# Altium schematic sheet GUAGE.SchDoc
size 420 x 297 mm; Date: 28.05.2024; ApprovedBy: Arda B.; CheckedBy: Arda B.; DrawnBy: Arda Bozkurt; Revision: 001; SheetNumber: 4; SheetTotal: 5; Department: HDD; Size: A3; Time: 28.05.2024
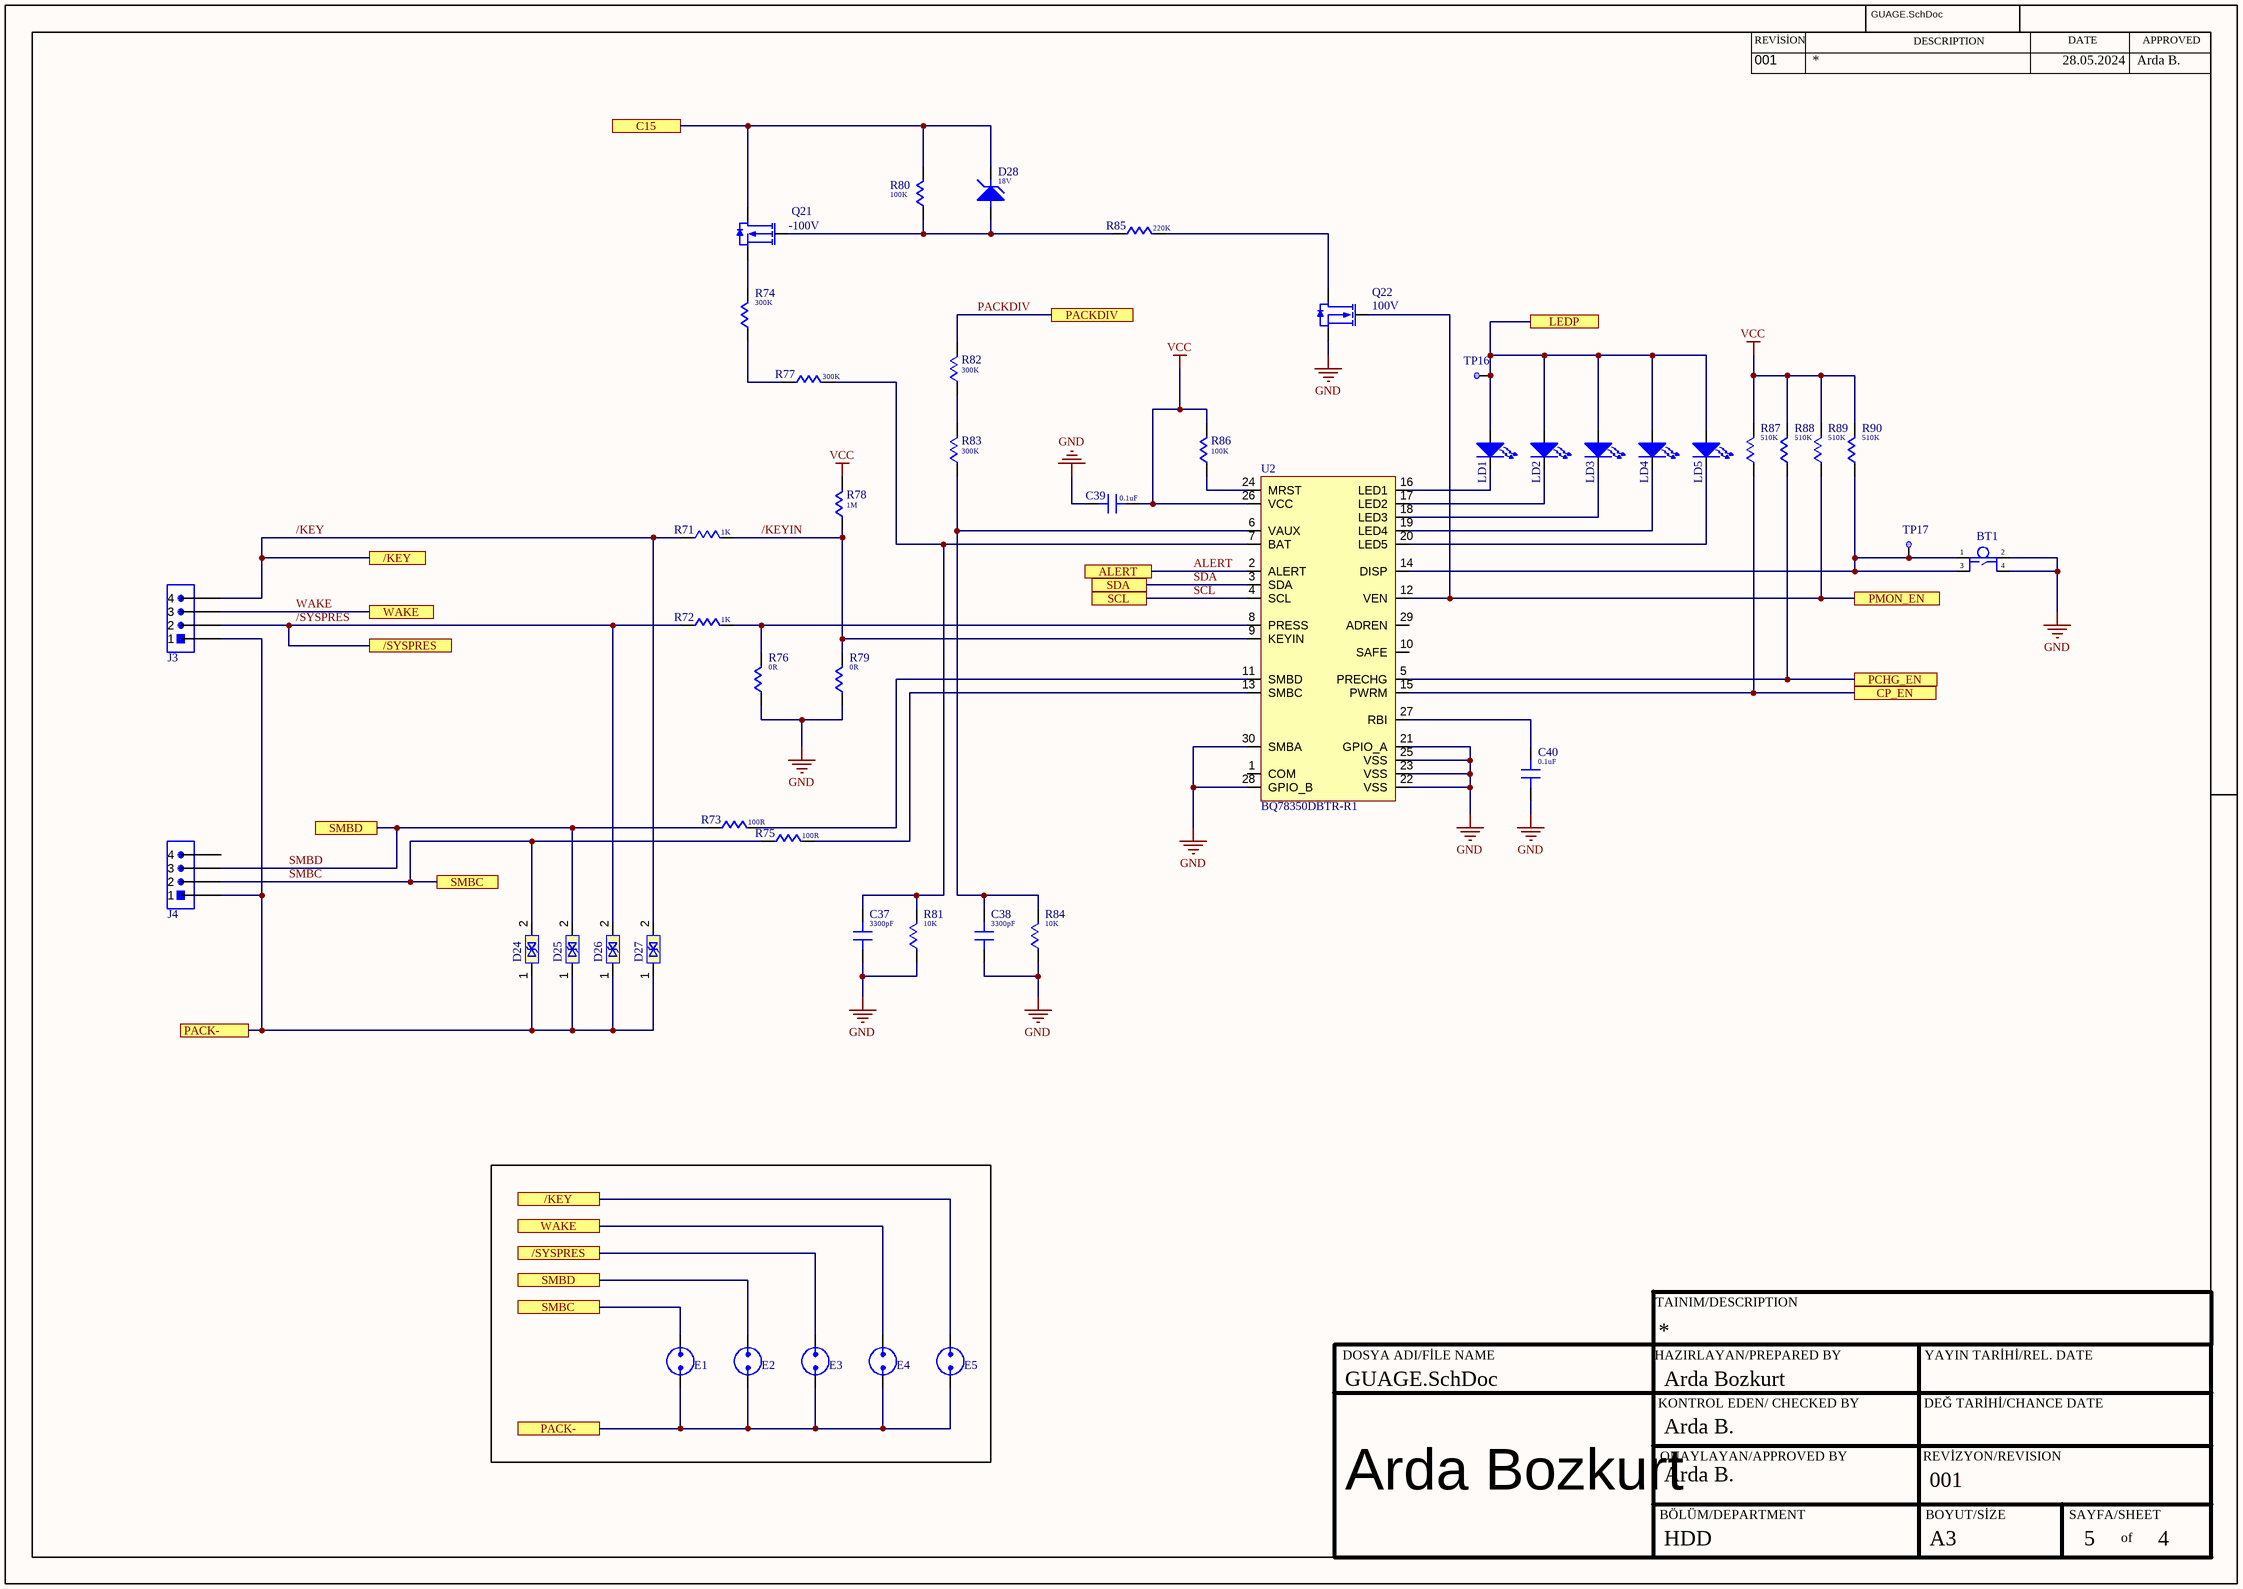
[diagram p0: GUAGE.SchDoc]

## Parts
BT1  1977223-6  [BUTTOM]  (value not drawn)
C37  value 3300pF  [C_0603]  (hidden comment: GRM188R71E332KA01D)
C38  value 3300pF  [C_0603]  (hidden comment: GRM188R71E332KA01D)
C39  value 0.1uF  [C_0603]  (hidden comment: C1608X7R1H104K080AA)
C40  value 0.1uF  [C_0603]  (hidden comment: C1608X7R1H104K080AA)
D24  TPD1E10B06DPYT  [ESD_X1SON]  (value not drawn)
D25  TPD1E10B06DPYT  [ESD_X1SON]  (value not drawn)
D26  TPD1E10B06DPYT  [ESD_X1SON]  (value not drawn)
D27  TPD1E10B06DPYT  [ESD_X1SON]  (value not drawn)
D28  value 18V  [D_SOD323]  (hidden comment: MMSZ5248BS-7-F)
E1  SPARKGAP  [SPARK_GARP]  (value not drawn)
E2  SPARKGAP  [SPARK_GARP]  (value not drawn)
E3  SPARKGAP  [SPARK_GARP]  (value not drawn)
E4  SPARKGAP  [SPARK_GARP]  (value not drawn)
E5  SPARKGAP  [SPARK_GARP]  (value not drawn)
J3  0022053041  [CONN_4]  (value not drawn)
J4  0022053041  [CONN_4]  (value not drawn)
LD1  LTST-C190GKT  [LED_0603]  (value not drawn)
LD2  LTST-C190GKT  [LED_0603]  (value not drawn)
LD3  LTST-C190GKT  [LED_0603]  (value not drawn)
LD4  LTST-C190GKT  [LED_0603]  (value not drawn)
LD5  LTST-C190GKT  [LED_0603]  (value not drawn)
Q21  Voltage Rating (DC): -100V  [Q_SOT23-3]  (hidden comment: ZXMP10A13FTA)
Q22  Voltage: 100V  [Q_SOT23-3]  (hidden comment: BSS123)
R71  value 1K  [R_0603]  (hidden comment: CRCW06031K00JNEA)
R72  value 1K  [R_0603]  (hidden comment: CRCW06031K00JNEA)
R73  value 100R  [R_0603]  (hidden comment: CRCW0603100RJNEA)
R74  value 300K  [R_0603]  (hidden comment: RG1608P-304-B-T5)
R75  value 100R  [R_0603]  (hidden comment: CRCW0603100RJNEA)
R76  value 0R  [R_0603]  (hidden comment: CRCW06030000Z0EA)
R77  value 300K  [R_0603]  (hidden comment: RG1608P-304-B-T5)
R78  value 1M  [R_0603]  (hidden comment: CRCW06031M00JNEA)
R79  value 0R  [R_0603]  (hidden comment: CRCW06030000Z0EA)
R80  value 100K  [R_0603]  (hidden comment: CRCW0603100KJNEA)
R81  value 10K  [R_0603]  (hidden comment: RG1608P-103-B-T5)
R82  value 300K  [R_0603]  (hidden comment: RG1608P-304-B-T5)
R83  value 300K  [R_0603]  (hidden comment: RG1608P-304-B-T5)
R84  value 10K  [R_0603]  (hidden comment: RG1608P-103-B-T5)
R85  value 220K  [R_0603]  (hidden comment: CRCW0603220KJNEA)
R86  value 100K  [R_0603]  (hidden comment: CRCW0603100KJNEA)
R87  value 510K  [R_0603]  (hidden comment: CRCW0603510KJNEA)
R88  value 510K  [R_0603]  (hidden comment: CRCW0603510KJNEA)
R89  value 510K  [R_0603]  (hidden comment: CRCW0603510KJNEA)
R90  value 510K  [R_0603]  (hidden comment: CRCW0603510KJNEA)
TP16  5011  [TP_VİA]  (value not drawn)
TP17  5011  [TP_VİA]  (value not drawn)
U2  BQ78350DBTR-R1  [30TSSOP]

## Ports
/KEY (see GUAGE[1B]), /KEY (see GUAGE[2D]), /SYSPRES (see GUAGE[1B]), /SYSPRES (see GUAGE[2D]), ALERT (see AFE[8D]), C15 (see AFE[11I], FET[3B]), CP_EN (see FET[3D]), LEDP (see AFE[5D]), PACK- (see FET[6A], GUAGE[1C]), PACK- (see FET[6A], GUAGE[2D]), PACKDIV (see FET[3D]), PCHG_EN (see FET[3D]), PMON_EN (see FET[3D]), SCL (see AFE[6C]), SDA (see AFE[6C]), SMBC (see GUAGE[2C]), SMBC (see GUAGE[2D]), SMBD (see GUAGE[1C]), SMBD (see GUAGE[2D]), WAKE (see AFE[3G], GUAGE[1B]), WAKE (see AFE[3G], GUAGE[2D])

## Nets
GND: BT1.2 BT1.4 C37.1 C38.1 C39.1 C40.1 Q22.2(S) R76.1 R79.1 R81.1 R84.1 U2.21(GPIO_A) U2.22(VSS) U2.23(VSS) U2.25(VSS) U2.28(GPIO_B) U2.30(SMBA)
VCC: C39.2 R78.2 R86.2 R87.2 R88.2 R89.2 R90.2 U2.26(VCC)
/KEY: D27.2 E5.1 J3.4 R71.1 ; port /KEY
/KEYIN: R71.2 R78.1 R79.2 U2.9(KEYIN)
/SYSPRES: D26.2 E3.1 J3.2 R72.1 ; port /SYSPRES
ALERT: U2.2(ALERT) ; port ALERT
C15: D28.1 Q21.2(S) R80.2 ; port C15
CP_EN: R87.1 U2.15(PWRM) ; port CP_EN
LEDP: LD1.2 LD2.2 LD3.2 LD4.2 LD5.2 TP16.1 ; port LEDP
PACK-: D24.1 D25.1 D26.1 D27.1 E1.2 E2.2 E3.2 E4.2 E5.2 J3.1 J4.1 ; port PACK-
PACKDIV: R82.2 ; port PACKDIV
PCHG_EN: R88.1 U2.5(PRECHG) ; port PCHG_EN
PMON_EN: Q22.1(G) R89.1 U2.12(VEN) ; port PMON_EN
SCL: U2.4(SCL) ; port SCL
SDA: U2.3(SDA) ; port SDA
SMBC: D24.2 E1.1 J4.2 R75.1 ; port SMBC
SMBD: D25.2 E2.1 J4.3 R73.1 ; port SMBD
WAKE: E4.1 J3.3 ; port WAKE
NetBT1_1: BT1.1 BT1.3 R90.1 TP17.1 U2.14(DISP)
NetC37_2: C37.2 R77.2 R81.2 U2.7(BAT)
NetC38_2: C38.2 R83.1 R84.2 U2.6(VAUX)
NetC40_2: C40.2 U2.27(RBI)
NetD28_2: D28.2 Q21.1(G) R80.1 R85.1
NetLD1_1: LD1.1 U2.16(LED1)
NetLD2_1: LD2.1 U2.17(LED2)
NetLD3_1: LD3.1 U2.18(LED3)
NetLD4_1: LD4.1 U2.19(LED4)
NetLD5_1: LD5.1 U2.20(LED5)
NetQ21_3: Q21.3(D) R74.2
NetQ22_3: Q22.3(D) R85.2
NetR72_2: R72.2 R76.2 U2.8(PRESS)
NetR73_2: R73.2 U2.11(SMBD)
NetR74_1: R74.1 R77.1
NetR75_2: R75.2 U2.13(SMBC)
NetR82_1: R82.1 R83.2
NetR86_1: R86.1 U2.24(MRST)

Not connected (* = marked no-connect by the designer): J4 4; U2 1(COM) 10(SAFE) 29(ADREN)

## Notes on the sheet
- REVİSİON
- DESCRIPTION
- DATE
- APPROVED
- TAINIM/DESCRIPTION
- DOSYA ADI/FİLE NAME
- HAZIRLAYAN/PREPARED BY
- KONTROL EDEN/ CHECKED BY
- YAYIN TARİHİ/REL. DATE
- DEĞ TARİHİ/CHANCE DATE
- ONAYLAYAN/APPROVED BY
- REVİZYON/REVISION
- Arda Bozkurt
- BÖLÜM/DEPARTMENT
- BOYUT/SİZE
- SAYFA/SHEET
- of

## Library data of the parts
BT1 = BT_SWITCH_TACTILE_0.05A_24V: Pushbutton Switch, SPST, Momentary, 0.05A, 24VDC, Solder Terminal, Panel Mount; Manufacturer: TE Connectivity; Manufacturer Part Number: FSM4JSMA; Actuator Material: Polyphenylene; Mechanical Life: 100000Cycles; Operating Force: 1.57N; Illumination Type: Non-Illuminated,Illuminated; Switch Function: Off-Mom; Switch Travel: 0.25mm; Current Rating: 50mA; Voltage Rating (DC): 24V; Actuator Type: Standard; Insulation Resistance: 100MR; Actuator Length: 1.4mm; Number of Positions: 2NUMBER; Supplier: Farnell; Supplier Part Number: 3801305; RoHS: Yes; Category: Pushbutton Switches; Stock: 16293; Pricing: 10=0,175, 50=0,173, 100=0,171, 500=0,168 (EUR); Mounting Technology: Surface Mount; Case/Package: SMD/SMT; Contact Material: Copper Alloy,Silver; Contact Plating: Silver; Color: Black; Min Operating Temperature: -35°C; Max Operating Temperature: 85°C; Packaging: Bulk; Throw Configuration: SPST; Termination: Gull Wing; Contact Current Rating: 50mA; Orientation: Straight; Series: FSMJSMA; Max Current Rating: 50mA; Voltage Rating: 24V; Package Quantity: 750; Length: 6mm; Width: 6mm; Depth: 10mm; Reach SVHC Compliant: Unknown; Lead Free: Lead Free; RoHS Compliant: Yes; ELV: Compliant; ComponentLink1URL: https://datasheet.ciiva.com/16312/1977223-8-16312304.pdf?src-supplier=Future+Electronics; ComponentLink1Description: https://datasheet.ciiva.com/16312/1977223-8-16312304.pdf?src-supplier=Future+Electronics; ComponentLink2URL: https://datasheet.ciiva.com/30161/19772236780a-30161988.pdf?src-supplier=Onlinecomponents.com; ComponentLink2Description: https://datasheet.ciiva.com/30161/19772236780a-30161988.pdf?src-supplier=Onlinecomponents.com; ComponentLink3URL: https://datasheet.ciiva.com/41839/eng-cd-1977223-a4-41839198.pdf?src-supplier=Digikey; ComponentLink3Description: https://datasheet.ciiva.com/41839/eng-cd-1977223-a4-41839198.pdf?src-supplier=Digikey; ComponentLink4URL: https://datasheet.ciiva.com/41834/eng-cd-1977223-a4-41834279.pdf?src-supplier=Digikey; ComponentLink4Description: https://datasheet.ciiva.com/41834/eng-cd-1977223-a4-41834279.pdf?src-supplier=Digikey
C37 C38 = C_3300pF_0603_25V: Multilayer Ceramic Capacitor, 0.1 uF, 100 V, ± 10%, X7R, 0603 [1608 Metric]; Manufacturer: Murata; Manufacturer Part Number: GRM188R72A104KA35D; Voltage Rating: 100V; Supplier: Mouser; Supplier Part Number: 81-GRM188R72A104KA35; RoHS: Yes; Category: Ceramic Capacitors; Stock: 809956; Pricing: 1=0,2, 10=0,086, 50=0,086, 100=0,05, 1000=0,043, 10000=0,035 (USD); Mounting Technology: Surface Mount; Case/Package: 0603; Weight: 0.000222oz; Case Code (Imperial): 0603; Case Code (Metric): 1608; Material: Ceramic; Min Operating Temperature: -55°C; Max Operating Temperature: 125°C; Voltage Rating (DC): 100V; Tolerance: 10%; Packaging: Tape and Reel; Package Quantity: 1; Dielectric: X7R; Termination: SMD/SMT; Voltage: 100V; Series: GRM; Construction: Flat; Length: 1.6mm; Width: 0.031inch; Height: 0.8mm; Thickness: 0.035inch; Depth: 0.8mm; Size: 0.8mm; Radiation Hardening: No; Reach SVHC Compliant: No; RoHS Compliant: Yes; Lead Free: 5697LeadFree; ComponentLink1URL: https://datasheet.ciiva.com/18100/getdatasheetpartid-27818-18100710.pdf?src-supplier=Verical; ComponentLink1Description: https://datasheet.ciiva.com/18100/getdatasheetpartid-27818-18100710.pdf?src-supplier=Verical
C39 C40 = C_0.1uF_0603_50V: Ceramic Capacitor, Multilayer, Ceramic, 50V, 10% -Tol, X7R, 15% Tc, 0.1Uf, Surface Mount, 0603; Manufacturer: TDK; Material: 4241ConductorMaterial; Supplier: Mouser; Supplier Part Number: 810-C1608X7R1H104K; Manufacturer Part Number: C1608X7R1H104K080AA; RoHS: Yes; Category: Ceramic Capacitors; Stock: 870852; Pricing: 1=0,1, 10=0,041, 50=0,041, 100=0,024, 1000=0,018, 10000=0,015 (USD); Mounting Technology: Surface Mount; Case/Package: 0603; Pins: 2NUMBER; Case Code (Imperial): 0603; Case Code (Metric): 1608; Dielectric Material: 4241ConductorMaterial; Min Operating Temperature: -55°C; Max Operating Temperature: 125°C; Voltage Rating: 50V; Tolerance: 10%; Packaging: Tape and Reel; Package Quantity: 1; Dielectric: X7R; Termination: SMD/SMT; Voltage: 50V; Series: C; Construction: Flat; Length: 1.6mm; Width: 0.031inch; Height: 0.8mm; Thickness: 0.037inch; Depth: 0.8mm; Reach SVHC Compliant: No; RoHS Compliant: Yes; Lead Free: 5697LeadFree
D24-D27 = ESD_TVS_DİODE_5.5VWM_14VC_2X1SON: 12-pF, ±5.5V, ±30-kV ESD protection diode in 0402 and SOD-523 package 2-X1SON -40 to 125; Manufacturer: Texas Instruments; Direction: Bidirectional; Value: 12pF; Number of Bidirectional Channels: 1; Min Breakdown Voltage: 6V; Clamping Voltage: 14V; Peak Pulse Power: 90W; Power Line Protection: No; Leakage Current: 100nA; Peak Pulse Current: 5A; Interface: GPIO; Diode Type: ZENER; Supplier: Mouser; Supplier Part Number: 595-TPD1E10B06DPYT; Manufacturer Part Number: TPD1E10B06DPYT; RoHS: Yes; Category: Integrated Circuits (ICs); Stock: 43416; Pricing: 1=0,86, 10=0,743, 50=0,743, 100=0,514, 1000=0,383, 10000=0,31 (USD); Case/Package: 0402; Pins: 2; Case Code (Imperial): 0402; Case Code (Metric): 1006; Min Operating Temperature: -40°C; Max Operating Temperature: 125°C; Packaging: Tape and Reel; Package Quantity: 250; Reverse Standoff Voltage: 5.5V; Working Voltage: 5.5V; Max Power Dissipation: 90W; Number of Channels: 1; Breakdown Voltage: 6V; Series: -; Length: 1.1mm; Width: 1mm; Thickness: 370um; Radiation Hardening: No; Lead Free: Lead Free; RoHS Compliant: Yes; ComponentLink1URL: https://datasheet.ciiva.com/12545/tpd1e10b06-213725-12545103.pdf?src-supplier=Mouser; ComponentLink1Description: https://datasheet.ciiva.com/12545/tpd1e10b06-213725-12545103.pdf?src-supplier=Mouser; ComponentLink2URL: https://datasheet.ciiva.com/15186/getdatasheetpartid-726218-15186786.pdf?src-supplier=Verical; ComponentLink2Description: https://datasheet.ciiva.com/15186/getdatasheetpartid-726218-15186786.pdf?src-supplier=Verical; ComponentLink3URL: https://datasheet.ciiva.com/14195/tpd1e10b06-14195181.pdf?src-supplier=Avnet; ComponentLink3Description: https://datasheet.ciiva.com/14195/tpd1e10b06-14195181.pdf?src-supplier=Avnet; ComponentLink4URL: https://datasheet.ciiva.com/6574/tpd1e10b06-6574669.pdf?src-supplier=Digikey; ComponentLink4Description: https://datasheet.ciiva.com/6574/tpd1e10b06-6574669.pdf?src-supplier=Digikey
D28 = D_ZENER_18V_SOD323: Diode Zener Single 18V 5% 200mW Automotive 2-Pin SOD-323 T/R; Manufacturer: Diodes; Supplier: Mouser; Supplier Part Number: 621-MMSZ5248BS-F; Manufacturer Part Number: MMSZ5248BS-7-F; RoHS: Yes; Category: Zener Diodes; Stock: 6211; Pricing: 1=0,33, 10=0,22, 50=0,22, 100=0,094, 1000=0,072, 10000=0,05 (USD); ComponentLink1URL: https://datasheet.ciiva.com/8347/ds18010-8347928.pdf?src-supplier=Avnet; ComponentLink1Description: https://datasheet.ciiva.com/8347/ds18010-8347928.pdf?src-supplier=Avnet; ComponentLink2URL: https://datasheet.ciiva.com/892/ds31038-892342.pdf?src-supplier=Digikey; ComponentLink2Description: https://datasheet.ciiva.com/892/ds31038-892342.pdf?src-supplier=Digikey; ComponentLink3URL: https://datasheet.ciiva.com/892/ds31038-892343.pdf?src-supplier=Digikey; ComponentLink3Description: https://datasheet.ciiva.com/892/ds31038-892343.pdf?src-supplier=Digikey; ComponentLink4URL: https://datasheet.ciiva.com/892/ds31038-892344.pdf?src-supplier=Digikey; ComponentLink4Description: https://datasheet.ciiva.com/892/ds31038-892344.pdf?src-supplier=Digikey; ComponentLink5URL: https://datasheet.ciiva.com/8025/ds31038-8025788.pdf?src-supplier=Element14; ComponentLink5Description: https://datasheet.ciiva.com/8025/ds31038-8025788.pdf?src-supplier=Element14
E1-E5 = E_Spark_Gap: Spark Gap
J3 J4 = J_CONN_4POS_2.54MM: KK 254 Solid Header, Right-Angle, with Friction Lock, 4 Circuits, Tin (Sn) Plating; Manufacturer: Molex; Contact Resistance: 10mR; Max Current Rating: 4A; Voltage Rating: 250V; Number of Positions: 4; Gender: Male; Insulation Resistance: 50GR; Pitch: 2.54mm; Approvals: UL,CSA; Glow Wire Compliant: Non-compliant; Supplier: Mouser; Supplier Part Number: 538-22-05-3041; Manufacturer Part Number: 22-05-3041; RoHS: Yes; Category: Headers and Wire Housings; Stock: 16509; Pricing: 1=0,68, 10=0,597, 50=0,597, 100=0,493, 1000=0,353, 10000=0,31 (USD); Mounting Technology: Through Hole; Contact Plating: Tin,Copper; Contact Material: Brass; Color: White; Housing Color: White; Housing Material: Nylon; Min Operating Temperature: 0°C; Max Operating Temperature: 75°C; Number of Rows: 1; Packaging: Bulk; Current Rating: 4A; Package Quantity: 12000; Contact Gender: Male; Termination: Solder; Number of Contacts: 4; Orientation: Right Angle; Voltage Rating (DC): 250V; Number of Circuits: 4; Fastening Type: Friction; Series: KK® 7478; Contact Type: Male Pin; Length: 10.16mm; Height: 6.35mm; Depth: 12.83mm; Contact Mating Length: 0.264inch; Radiation Hardening: No; Halogen Free: Low Halogen; Lead Free: Lead Free; Flammability Rating: UL94 V-0; RoHS Compliant: Yes; Reach SVHC Compliant: Unknown
LD1-LD5 = LED_GREEN_0603: LED Uni-Color Green 565nm 2-Pin Chip LED T/R; Manufacturer: Vishay Lite-On; Lens Color: Colorless; Luminous Intensity: 6mcd; Forward Voltage: 2.1V; Viewing Angle: 130°; Lens Style: Flat,Diffused,Colorless,Rectangular,Clear; Forward Current: 30mA; Dominant Wavelength: 569nm; Test Current: 10mA; Lens Transparency: Clear; Number of Elements: 1; Power Dissipation: 100mW; Reverse Voltage: 5V; Voltage: 2V; Lens Size: 0.8mm; Supplier: Future Electronics; Supplier Part Number: 3106685; Manufacturer Part Number: LTST-C190GKT; RoHS: Yes; Category: LEDs; Stock: 190; Pricing: 1=0,184, 15=0,137, 100=0,104, 400=0,0802, 2000=0,0524 (USD); Mounting Technology: Surface Mount; Case/Package: 0603; Pins: 2; Color: Green; Case Code (Metric): 1608; Case Code (Imperial): 0603; Min Operating Temperature: -55°C; Max Operating Temperature: 85°C; Package Quantity: 1; Packaging: Tape and Reel; Illumination Color: Green; Wavelength: 565nm; Number of LEDs: 1; Power Rating: 100mW; Series: -; Length: 1.6mm; Width: 0.8mm; Height: 0.9mm; Depth: 0.8mm; Radiation Hardening: No; Lead Free: Lead Free; RoHS Compliant: Yes; ComponentLink1URL: https://datasheet.ciiva.com/2109/ltst-c190gkt-2109985.pdf?src-supplier=Digikey; ComponentLink1Description: https://datasheet.ciiva.com/2109/ltst-c190gkt-2109985.pdf?src-supplier=Digikey; ComponentLink2URL: https://datasheet.ciiva.com/11775/0900766b80dc02a6-11775616.pdf?src-supplier=Rs; ComponentLink2Description: https://datasheet.ciiva.com/11775/0900766b80dc02a6-11775616.pdf?src-supplier=Rs; ComponentLink3URL: https://datasheet.ciiva.com/12403/lite-on-ltst-c190gkt-187204-12403884.pdf?src-supplier=Mouser; ComponentLink3Description: https://datasheet.ciiva.com/12403/lite-on-ltst-c190gkt-187204-12403884.pdf?src-supplier=Mouser; ComponentLink4URL: https://datasheet.ciiva.com/16392/lite-on20ltst-c190gkt-16392818.pdf?src-supplier=Future+Electronics; ComponentLink4Description: https://datasheet.ciiva.com/16392/lite-on20ltst-c190gkt-16392818.pdf?src-supplier=Future+Electronics; ComponentLink5URL: https://datasheet.ciiva.com/2109/ltst-c190gkt-2109986.pdf?src-supplier=Digikey; ComponentLink5Description: https://datasheet.ciiva.com/2109/ltst-c190gkt-2109986.pdf?src-supplier=Digikey; ComponentLink6URL: https://datasheet.ciiva.com/2109/ltst-c190gkt-2109987.pdf?src-supplier=Digikey; ComponentLink6Description: https://datasheet.ciiva.com/2109/ltst-c190gkt-2109987.pdf?src-supplier=Digikey
Q21 = Q_MOSFET_100V_SOT23-3_1: P-Channel 100 V 1 Ohm Surface Mount Enhancement Mode MOSFET - SOT-23; Manufacturer: Diodes Zetex; Current Rating: -500mA; Supplier: Future Electronics; Supplier Part Number: 3181252; Manufacturer Part Number: ZXMP10A13FTA; RoHS: Yes; Category: MOSFETs; Stock: 1053000; Pricing: 3000=0,16, 6000=0,157, 9000=0,155, 12000=0,154, 15000=0,15 (USD); Lead Free: 5697LeadFree; ComponentLink1URL: https://datasheet.ciiva.com/6383/zxmp10a13f-6383089.pdf?src-supplier=Digikey; ComponentLink1Description: https://datasheet.ciiva.com/6383/zxmp10a13f-6383089.pdf?src-supplier=Digikey; ComponentLink2URL: https://datasheet.ciiva.com/11175/zxmp10a13f-11175011.pdf?src-supplier=Avnet; ComponentLink2Description: https://datasheet.ciiva.com/11175/zxmp10a13f-11175011.pdf?src-supplier=Avnet; ComponentLink3URL: https://datasheet.ciiva.com/17097/zxmp10a13fta-17097946.pdf?src-supplier=Allied+Electronics; ComponentLink3Description: https://datasheet.ciiva.com/17097/zxmp10a13fta-17097946.pdf?src-supplier=Allied+Electronics; ComponentLink4URL: https://datasheet.ciiva.com/16387/zxmp10a13f-16387581.pdf?src-supplier=Future+Electronics; ComponentLink4Description: https://datasheet.ciiva.com/16387/zxmp10a13f-16387581.pdf?src-supplier=Future+Electronics; ComponentLink5URL: https://datasheet.ciiva.com/22712/1915646-22712428.pdf?src-supplier=Element14; ComponentLink5Description: https://datasheet.ciiva.com/22712/1915646-22712428.pdf?src-supplier=Element14; ComponentLink6URL: https://datasheet.ciiva.com/6383/zxmp10a13f-6383087.pdf?src-supplier=Digikey; ComponentLink6Description: https://datasheet.ciiva.com/6383/zxmp10a13f-6383087.pdf?src-supplier=Digikey
Q22 = Q_MOSFET_100V_SOT23-3: Transistor MOSFET Negative Channel 100 Volt 0.17A 3-Pin SOT-23; Manufacturer: ON Semiconductor / Fairchild; Number of Channels: 1NUMBER; Supplier: Future Electronics; Supplier Part Number: 1056753; Manufacturer Part Number: BSS123; RoHS: Yes; Category: MOSFETs; Stock: 351000; Pricing: 3000=0,0465, 9000=0,0447, 15000=0,0439, 30000=0,0429, 60000=0,0412 (USD)
R71 R72 = R_1K_%5_1/10W_0603: SMD Chip Resistor, 1 kOhm, ± 5%, 100 mW, 0603 [1608 Metric], Thick Film, General Purpose; Manufacturer: Vishay Dale; Temperature Coefficient: 200ppm/°C; Voltage Rating (DC): 75V; Power Rating: 100mW; Supplier: Mouser; Supplier Part Number: 71-CRCW0603J-1.0K-E3; Manufacturer Part Number: CRCW06031K00JNEA; RoHS: Yes; Category: Chip SMD Resistors; Stock: 120124; Pricing: 1=0,1, 10=0,016, 50=0,016, 100=0,009, 1000=0,006, 10000=0,003 (USD); Case/Package: 0603; Pins: 2; Contact Plating: Tin; Case Code (Metric): 1608; Case Code (Imperial): 0603; Weight: 7.1E-05oz; Min Operating Temperature: -55°C; Max Operating Temperature: 155°C; Tolerance: 5%; Resistor Type: Thick Film; Packaging: Tape and Reel; Package Quantity: 1; Voltage Rating: 75V; Number of Terminations: 2; Termination: SMD/SMT; Max Power Dissipation: 100mW; Features: Automotive AEC-Q200; Series: CRCW; Resistance Tolerance: 5%; Construction: Rectangular; Length: 1.55mm; Width: 0.033inch; Height: 0.02inch; Depth: 0.85mm; Radiation Hardening: No; Lead Free: Lead Free; RoHS Compliant: Yes; Reach SVHC Compliant: Unknown; Military Standard: Not; ComponentLink1URL: https://datasheet.ciiva.com/46441/1533075-46441625.pdf?src-supplier=Element14; ComponentLink1Description: https://datasheet.ciiva.com/46441/1533075-46441625.pdf?src-supplier=Element14; ComponentLink2URL: https://datasheet.ciiva.com/28621/1847332-28621386.pdf?src-supplier=Element14; ComponentLink2Description: https://datasheet.ciiva.com/28621/1847332-28621386.pdf?src-supplier=Element14; ComponentLink3URL: https://datasheet.ciiva.com/2462/dcrcwe3-2462023.pdf?src-supplier=Digikey; ComponentLink3Description: https://datasheet.ciiva.com/2462/dcrcwe3-2462023.pdf?src-supplier=Digikey; ComponentLink4URL: https://datasheet.ciiva.com/2462/dcrcwe3-2462024.pdf?src-supplier=Digikey; ComponentLink4Description: https://datasheet.ciiva.com/2462/dcrcwe3-2462024.pdf?src-supplier=Digikey; ComponentLink5URL: https://datasheet.ciiva.com/2462/dcrcwe3-2462022.pdf?src-supplier=Digikey; ComponentLink5Description: https://datasheet.ciiva.com/2462/dcrcwe3-2462022.pdf?src-supplier=Digikey; ComponentLink6URL: https://datasheet.ciiva.com/5548/dcrcwe3-109170-5548152.pdf?src-supplier=Mouser; ComponentLink6Description: https://datasheet.ciiva.com/5548/dcrcwe3-109170-5548152.pdf?src-supplier=Mouser; ComponentLink7URL: https://datasheet.ciiva.com/16211/dcrcwe3-16211589.pdf?src-supplier=Future+Electronics; ComponentLink7Description: https://datasheet.ciiva.com/16211/dcrcwe3-16211589.pdf?src-supplier=Future+Electronics
R73 R75 = R_100OHM_%5_1/10W_0603: SMD Chip Resistor, 100 Ohm, ± 5%, 100 mW, 0603 [1608 Metric], Thick Film, General Purpose; Manufacturer: Vishay Dale; Temperature Coefficient: 200ppm/°C; Voltage Rating: 75V; Power Rating: 100mW; Supplier: Mouser; Supplier Part Number: 71-CRCW0603J-100-E3; Manufacturer Part Number: CRCW0603100RJNEA; RoHS: Yes; Category: Chip SMD Resistors; Stock: 90610; Pricing: 1=0,1, 10=0,028, 50=0,028, 100=0,011, 1000=0,005, 10000=0,003 (USD); Case/Package: 0603; Contact Plating: Tin; Weight: 7.1E-05oz; Case Code (Imperial): 0603; Case Code (Metric): 1608; Min Operating Temperature: -55°C; Max Operating Temperature: 155°C; Tolerance: 5%; Packaging: Tape and Reel; Package Quantity: 5000; Resistor Type: Thick Film; Number of Terminations: 2; Termination: SMD/SMT; Max Power Dissipation: 100mW; Features: Automotive AEC-Q200; Series: CRCW; Resistance Tolerance: 5%; Construction: Rectangular; Length: 1.55mm; Width: 0.85mm; Height: 0.45mm; Depth: 0.85mm; Ratings: AEC-Q200; Radiation Hardening: No; Military Standard: Not; RoHS Compliant: Yes; Reach SVHC Compliant: Unknown; Lead Free: 5697LeadFree; ComponentLink1URL: https://datasheet.ciiva.com/26944/getdatasheetpartid-45824-26944476.pdf?src-supplier=Verical; ComponentLink1Description: https://datasheet.ciiva.com/26944/getdatasheetpartid-45824-26944476.pdf?src-supplier=Verical; ComponentLink2URL: https://datasheet.ciiva.com/2461/dcrcwe3-2461977.pdf?src-supplier=Digikey; ComponentLink2Description: https://datasheet.ciiva.com/2461/dcrcwe3-2461977.pdf?src-supplier=Digikey; ComponentLink3URL: https://datasheet.ciiva.com/16755/70201119-16755598.pdf?src-supplier=Allied+Electronics; ComponentLink3Description: https://datasheet.ciiva.com/16755/70201119-16755598.pdf?src-supplier=Allied+Electronics; ComponentLink4URL: https://datasheet.ciiva.com/16214/dcrcwe3-16214053.pdf?src-supplier=Future+Electronics; ComponentLink4Description: https://datasheet.ciiva.com/16214/dcrcwe3-16214053.pdf?src-supplier=Future+Electronics; ComponentLink5URL: https://datasheet.ciiva.com/28621/1912744-28621371.pdf?src-supplier=Element14; ComponentLink5Description: https://datasheet.ciiva.com/28621/1912744-28621371.pdf?src-supplier=Element14; ComponentLink6URL: https://datasheet.ciiva.com/2461/dcrcwe3-2461978.pdf?src-supplier=Digikey; ComponentLink6Description: https://datasheet.ciiva.com/2461/dcrcwe3-2461978.pdf?src-supplier=Digikey; ComponentLink7URL: https://datasheet.ciiva.com/2461/dcrcwe3-2461979.pdf?src-supplier=Digikey; ComponentLink7Description: https://datasheet.ciiva.com/2461/dcrcwe3-2461979.pdf?src-supplier=Digikey; ComponentLink8URL: https://datasheet.ciiva.com/16786/70201119-16786717.pdf?src-supplier=Allied+Electronics; ComponentLink8Description: https://datasheet.ciiva.com/16786/70201119-16786717.pdf?src-supplier=Allied+Electronics
R74 R77 R82 R83 = R_300K_%0.1_1/10W_0603: Res Thin Film 0603 300K Ohm 0.1% 0.1W(1/10W) ±25ppm/C Sulfur Resistant Pad SMD Automotive T/R; Manufacturer: Susumu; Supplier: Mouser; Supplier Part Number: 754-RG1608P-304-B-T5; Manufacturer Part Number: RG1608P-304-B-T5; RoHS: Yes; Category: Chip SMD Resistors; Stock: 20648; Pricing: 1=0,21, 10=0,119, 50=0,119, 100=0,107, 1000=0,069, 10000=0,051 (USD); ComponentLink1URL: https://datasheet.ciiva.com/5625/rg-rm-rgh-datasheet-5625690.pdf?src-supplier=Mouser; ComponentLink1Description: https://datasheet.ciiva.com/5625/rg-rm-rgh-datasheet-5625690.pdf?src-supplier=Mouser; ComponentLink2URL: https://datasheet.ciiva.com/17424/rg-rm-rgh-datasheet-17424710.pdf?src-supplier=Future+Electronics; ComponentLink2Description: https://datasheet.ciiva.com/17424/rg-rm-rgh-datasheet-17424710.pdf?src-supplier=Future+Electronics
R76 R79 = R_0OHM_1/10W_0603: Zero Ohm Resistor, Jumper, 0603 [1608 Metric], Thick Film, 330 mW, 5 A, Surface Mount; Manufacturer: Vishay Dale; Manufacturer Part Number: CRCW06030000Z0EAHP; Power Rating: 250mW; Voltage Rating: 75V; Temperature Coefficient: 0ppm/°C; Supplier: Mouser; Supplier Part Number: 71-CRCW06030000Z0EAH; RoHS: Yes; Category: Chip SMD Resistors; Stock: 1018937; Pricing: 1=0,14, 10=0,068, 50=0,068, 100=0,03, 1000=0,021, 10000=0,014 (USD); Case/Package: 0603; Pins: 2; Contact Plating: Tin; Case Code (Metric): 1608; Case Code (Imperial): 0603; Weight: 7.1E-05oz; Min Operating Temperature: -55°C; Max Operating Temperature: 155°C; Packaging: Tape and Reel; Resistor Type: Thick Film; Number of Terminations: 2; Termination: SMD/SMT; Max Power Dissipation: 250mW; Features: Automotive AEC-Q200; Series: CRCW-HP; Voltage Rating (DC): 75V; Package Quantity: 5000; Technology: THICK FILM; Construction: Rectangular; Length: 1.6mm; Width: 0.033inch; Height: 0.45mm; Depth: 0.85mm; Ratings: AEC-Q200; Radiation Hardening: No; Lead Free: 5697LeadFree; RoHS Compliant: Yes; Reach SVHC Compliant: Unknown; Military Standard: Not; ComponentLink1URL: https://datasheet.ciiva.com/8340/crcwhpe3-8340198.pdf?src-supplier=Avnet; ComponentLink1Description: https://datasheet.ciiva.com/8340/crcwhpe3-8340198.pdf?src-supplier=Avnet; ComponentLink2URL: https://datasheet.ciiva.com/16430/crcwhpe3-16430059.pdf?src-supplier=Future+Electronics; ComponentLink2Description: https://datasheet.ciiva.com/16430/crcwhpe3-16430059.pdf?src-supplier=Future+Electronics; ComponentLink3URL: https://datasheet.ciiva.com/2472/crcwhpe3-2472034.pdf?src-supplier=Digikey; ComponentLink3Description: https://datasheet.ciiva.com/2472/crcwhpe3-2472034.pdf?src-supplier=Digikey; ComponentLink4URL: https://datasheet.ciiva.com/2472/crcwhpe3-2472035.pdf?src-supplier=Digikey; ComponentLink4Description: https://datasheet.ciiva.com/2472/crcwhpe3-2472035.pdf?src-supplier=Digikey; ComponentLink5URL: https://datasheet.ciiva.com/2472/crcwhpe3-2472033.pdf?src-supplier=Digikey; ComponentLink5Description: https://datasheet.ciiva.com/2472/crcwhpe3-2472033.pdf?src-supplier=Digikey; ComponentLink6URL: https://datasheet.ciiva.com/28621/1912814-28621358.pdf?src-supplier=Element14; ComponentLink6Description: https://datasheet.ciiva.com/28621/1912814-28621358.pdf?src-supplier=Element14
R78 = R_1M_%5_1/10W_0603: SMD Chip Resistor, 1 MOhm, ± 5%, 100 mW, 0603 [1608 Metric], Thick Film, General Purpose; Manufacturer: Vishay Dale; Temperature Coefficient: 200ppm/°C; Power Rating: 100mW; Voltage Rating: 75V; Supplier: Mouser; Supplier Part Number: 71-CRCW0603J-1.0M-E3; Manufacturer Part Number: CRCW06031M00JNEA; RoHS: Yes; Category: Chip SMD Resistors; Stock: 24009; Pricing: 1=0,1, 10=0,014, 50=0,014, 100=0,009, 1000=0,007, 10000=0,003 (USD); Case/Package: 0603; Pins: 2; Contact Plating: Tin; Weight: 7.1E-05oz; Case Code (Imperial): 0603; Case Code (Metric): 1608; Min Operating Temperature: -55°C; Max Operating Temperature: 155°C; Tolerance: 5%; Packaging: Tape and Reel; Package Quantity: 5000; Termination: SMD/SMT; Resistor Type: Thick Film; Number of Terminations: 2; Max Power Dissipation: 100mW; Features: Automotive AEC-Q200; Series: CRCW; Construction: Rectangular; Resistance Tolerance: 5%; Length: 1.55mm; Width: 0.85mm; Height: 0.45mm; Depth: 0.85mm; Ratings: AEC-Q200; Radiation Hardening: No; RoHS Compliant: Yes; Lead Free: 5697LeadFree; Military Standard: Not; Reach SVHC Compliant: Unknown; ComponentLink1URL: https://datasheet.ciiva.com/2462/dcrcwe3-2462062.pdf?src-supplier=Digikey; ComponentLink1Description: https://datasheet.ciiva.com/2462/dcrcwe3-2462062.pdf?src-supplier=Digikey; ComponentLink2URL: https://datasheet.ciiva.com/2462/dcrcwe3-2462063.pdf?src-supplier=Digikey; ComponentLink2Description: https://datasheet.ciiva.com/2462/dcrcwe3-2462063.pdf?src-supplier=Digikey; ComponentLink3URL: https://datasheet.ciiva.com/2462/dcrcwe3-2462061.pdf?src-supplier=Digikey; ComponentLink3Description: https://datasheet.ciiva.com/2462/dcrcwe3-2462061.pdf?src-supplier=Digikey; ComponentLink4URL: https://datasheet.ciiva.com/5546/dcrcwe3-109170-5546629.pdf?src-supplier=Mouser; ComponentLink4Description: https://datasheet.ciiva.com/5546/dcrcwe3-109170-5546629.pdf?src-supplier=Mouser; ComponentLink5URL: https://datasheet.ciiva.com/3257/dcrcwe3-3257206.pdf?src-supplier=Avnet; ComponentLink5Description: https://datasheet.ciiva.com/3257/dcrcwe3-3257206.pdf?src-supplier=Avnet; ComponentLink6URL: https://datasheet.ciiva.com/16351/dcrcwe3-16351110.pdf?src-supplier=Future+Electronics; ComponentLink6Description: https://datasheet.ciiva.com/16351/dcrcwe3-16351110.pdf?src-supplier=Future+Electronics; ComponentLink7URL: https://datasheet.ciiva.com/3257/dcrcwe3-3257205.pdf?src-supplier=Avnet; ComponentLink7Description: https://datasheet.ciiva.com/3257/dcrcwe3-3257205.pdf?src-supplier=Avnet
R80 R86 = R_100K_%5_1/10W_0603: SMD Chip Resistor, 100 kOhm, ± 5%, 100 mW, 0603 [1608 Metric], Thick Film, General Purpose; Manufacturer: Vishay; Voltage Rating: 75V; Power Rating: 100mW; Temperature Coefficient: 200ppm/°C; Supplier: Mouser; Supplier Part Number: 71-CRCW0603J-100K-E3; Manufacturer Part Number: CRCW0603100KJNEA; RoHS: Yes; Category: Chip SMD Resistors; Stock: 65417; Pricing: 1=0,1, 10=0,016, 50=0,016, 100=0,009, 1000=0,007, 10000=0,003 (USD); Mounting Technology: Surface Mount; Case/Package: 0603; Pins: 2; Weight: 7.1E-05oz; Case Code (Imperial): 0603; Case Code (Metric): 1608; Contact Plating: Tin; Min Operating Temperature: -55°C; Max Operating Temperature: 155°C; Tolerance: 5%; Packaging: Tape and Reel; Package Quantity: 5000; Resistor Type: Thick Film; Number of Terminations: 2; Termination: SMD/SMT; Max Power Dissipation: 100mW; Working Voltage: 75V; Features: Automotive AEC-Q200; Series: CRCW; Resistance Tolerance: 5%; Technology: THICK FILM; Construction: Rectangular; Length: 1.55mm; Width: 0.85mm; Height: 0.45mm; Depth: 0.85mm; Ratings: AEC-Q200; Radiation Hardening: No; Lead Free: 5697LeadFree; Military Standard: Not; RoHS Compliant: Yes; Reach SVHC Compliant: Unknown; ComponentLink1URL: https://datasheet.ciiva.com/5852/1533075-5852048.pdf?src-supplier=Farnell; ComponentLink1Description: https://datasheet.ciiva.com/5852/1533075-5852048.pdf?src-supplier=Farnell; ComponentLink2URL: https://datasheet.ciiva.com/16783/70201119-16783119.pdf?src-supplier=Allied+Electronics; ComponentLink2Description: https://datasheet.ciiva.com/16783/70201119-16783119.pdf?src-supplier=Allied+Electronics; ComponentLink3URL: https://datasheet.ciiva.com/7777/1533075-7777272.pdf?src-supplier=Element14; ComponentLink3Description: https://datasheet.ciiva.com/7777/1533075-7777272.pdf?src-supplier=Element14; ComponentLink4URL: https://datasheet.ciiva.com/46441/1533075-46441621.pdf?src-supplier=Element14; ComponentLink4Description: https://datasheet.ciiva.com/46441/1533075-46441621.pdf?src-supplier=Element14; ComponentLink5URL: https://datasheet.ciiva.com/28621/1747939-28621367.pdf?src-supplier=Element14; ComponentLink5Description: https://datasheet.ciiva.com/28621/1747939-28621367.pdf?src-supplier=Element14; ComponentLink6URL: https://datasheet.ciiva.com/2461/dcrcwe3-2461981.pdf?src-supplier=Digikey; ComponentLink6Description: https://datasheet.ciiva.com/2461/dcrcwe3-2461981.pdf?src-supplier=Digikey; ComponentLink7URL: https://datasheet.ciiva.com/2461/dcrcwe3-2461982.pdf?src-supplier=Digikey; ComponentLink7Description: https://datasheet.ciiva.com/2461/dcrcwe3-2461982.pdf?src-supplier=Digikey; ComponentLink8URL: https://datasheet.ciiva.com/2461/dcrcwe3-2461980.pdf?src-supplier=Digikey; ComponentLink8Description: https://datasheet.ciiva.com/2461/dcrcwe3-2461980.pdf?src-supplier=Digikey; ComponentLink9URL: https://datasheet.ciiva.com/16767/70201119-16767110.pdf?src-supplier=Allied+Electronics; ComponentLink9Description: https://datasheet.ciiva.com/16767/70201119-16767110.pdf?src-supplier=Allied+Electronics; ComponentLink10URL: https://datasheet.ciiva.com/26820/getdatasheetpartid-30055-26820934.pdf?src-supplier=Verical; ComponentLink10Description: https://datasheet.ciiva.com/26820/getdatasheetpartid-30055-26820934.pdf?src-supplier=Verical
R81 R84 = R_10K_%0.1_1/10W_0603: Res Thin Film 0603 10K Ohm 0.1% 0.1W(1/10W) ±25ppm/C Sulfur Resistant Pad SMD Automotive T/R; Manufacturer: Susumu; Power Rating: 100mW; Voltage Rating: 100V; Temperature Coefficient: 25ppm/°C; Voltage Rating (DC): 75V; Supplier: Future Electronics; Supplier Part Number: 6000172; Manufacturer Part Number: RG1608P-103-B-T5; RoHS: Yes; Category: Chip SMD Resistors; Stock: 235000; Pricing: 5000=0,0666, 10000=0,065, 15000=0,0514, 20000=0,0634, 25000=0,0629, 75000=0,0599 (USD); Case/Package: 0603; Case Code (Imperial): 0603; Case Code (Metric): 1608; Weight: 7.1E-05oz; Min Operating Temperature: -55°C; Max Operating Temperature: 155°C; Tolerance: 0.1%; Packaging: Tape and Reel; Termination: SMD/SMT; Features: Automotive AEC-Q200,Anti-Sulfur; Series: RG; Max Power Dissipation: 100mW; Number of Terminations: 2; Length: 1.6mm; Width: 0.8mm; Height: 0.4mm; RoHS Compliant: Yes; Lead Free: 5697LeadFree; ComponentLink1URL: https://datasheet.ciiva.com/26874/getdatasheetpartid-697968-26874044.pdf?src-supplier=Verical; ComponentLink1Description: https://datasheet.ciiva.com/26874/getdatasheetpartid-697968-26874044.pdf?src-supplier=Verical; ComponentLink2URL: https://datasheet.ciiva.com/5624/rg-rm-rgh-datasheet-5624714.pdf?src-supplier=Mouser; ComponentLink2Description: https://datasheet.ciiva.com/5624/rg-rm-rgh-datasheet-5624714.pdf?src-supplier=Mouser
R85 = R_220K_%5_1/10W_0603: SMD Chip Resistor, 220 kOhm, ± 5%, 100 mW, 0603 [1608 Metric], Thick Film, General Purpose; Manufacturer: Vishay Dale; Voltage Rating (DC): 75V; Supplier: Mouser; Supplier Part Number: 71-CRCW0603J-220K-E3; Manufacturer Part Number: CRCW0603220KJNEA; RoHS: Yes; Category: Chip SMD Resistors; Stock: 26996; Pricing: 1=0,1, 10=0,017, 50=0,017, 100=0,008, 1000=0,006, 10000=0,003 (USD); Lead Free: 5697LeadFree; ComponentLink1URL: https://datasheet.ciiva.com/3257/dcrcwe3-3257263.pdf?src-supplier=Avnet; ComponentLink1Description: https://datasheet.ciiva.com/3257/dcrcwe3-3257263.pdf?src-supplier=Avnet; ComponentLink2URL: https://datasheet.ciiva.com/28606/1847332-28606727.pdf?src-supplier=Element14; ComponentLink2Description: https://datasheet.ciiva.com/28606/1847332-28606727.pdf?src-supplier=Element14; ComponentLink3URL: https://datasheet.ciiva.com/7386/1914725-7386263.pdf?src-supplier=Newark; ComponentLink3Description: https://datasheet.ciiva.com/7386/1914725-7386263.pdf?src-supplier=Newark; ComponentLink4URL: https://datasheet.ciiva.com/5545/dcrcwe3-109170-5545756.pdf?src-supplier=Mouser; ComponentLink4Description: https://datasheet.ciiva.com/5545/dcrcwe3-109170-5545756.pdf?src-supplier=Mouser; ComponentLink5URL: https://datasheet.ciiva.com/2462/dcrcwe3-2462337.pdf?src-supplier=Digikey; ComponentLink5Description: https://datasheet.ciiva.com/2462/dcrcwe3-2462337.pdf?src-supplier=Digikey; ComponentLink6URL: https://datasheet.ciiva.com/2462/dcrcwe3-2462338.pdf?src-supplier=Digikey; ComponentLink6Description: https://datasheet.ciiva.com/2462/dcrcwe3-2462338.pdf?src-supplier=Digikey; ComponentLink7URL: https://datasheet.ciiva.com/2462/dcrcwe3-2462339.pdf?src-supplier=Digikey; ComponentLink7Description: https://datasheet.ciiva.com/2462/dcrcwe3-2462339.pdf?src-supplier=Digikey
R87-R90 = R_510K_%5_1/10W_0603: SMD Chip Resistor, 510 kOhm, ± 5%, 100 mW, 0603 [1608 Metric], Thick Film, General Purpose; Manufacturer: Vishay Dale; Supplier: Mouser; Supplier Part Number: 71-CRCW0603J-510K-E3; Manufacturer Part Number: CRCW0603510KJNEA; RoHS: Yes; Category: Chip SMD Resistors; Stock: 25702; Pricing: 1=0,1, 10=0,016, 50=0,016, 100=0,009, 1000=0,007, 10000=0,004 (USD); ComponentLink1URL: https://datasheet.ciiva.com/8931/dcrcwe3-8931611.pdf?src-supplier=Avnet; ComponentLink1Description: https://datasheet.ciiva.com/8931/dcrcwe3-8931611.pdf?src-supplier=Avnet; ComponentLink2URL: https://datasheet.ciiva.com/3257/dcrcwe3-3257687.pdf?src-supplier=Avnet; ComponentLink2Description: https://datasheet.ciiva.com/3257/dcrcwe3-3257687.pdf?src-supplier=Avnet; ComponentLink3URL: https://datasheet.ciiva.com/5551/dcrcwe3-109170-5551196.pdf?src-supplier=Mouser; ComponentLink3Description: https://datasheet.ciiva.com/5551/dcrcwe3-109170-5551196.pdf?src-supplier=Mouser; ComponentLink4URL: https://datasheet.ciiva.com/2462/dcrcwe3-2462346.pdf?src-supplier=Digikey; ComponentLink4Description: https://datasheet.ciiva.com/2462/dcrcwe3-2462346.pdf?src-supplier=Digikey; ComponentLink5URL: https://datasheet.ciiva.com/2462/dcrcwe3-2462347.pdf?src-supplier=Digikey; ComponentLink5Description: https://datasheet.ciiva.com/2462/dcrcwe3-2462347.pdf?src-supplier=Digikey; ComponentLink6URL: https://datasheet.ciiva.com/2462/dcrcwe3-2462348.pdf?src-supplier=Digikey; ComponentLink6Description: https://datasheet.ciiva.com/2462/dcrcwe3-2462348.pdf?src-supplier=Digikey; ComponentLink7URL: https://datasheet.ciiva.com/16204/dcrcwe3-16204202.pdf?src-supplier=Future+Electronics; ComponentLink7Description: https://datasheet.ciiva.com/16204/dcrcwe3-16204202.pdf?src-supplier=Future+Electronics
TP16 TP17 = TP_PC_TEST_POİNT: TEST POINT, PCB, THROUGH HOLE; Product R; Range: -; Connector Colour: Black; Mounting: Through Hole; Manufacturer: Keystone Electronics; Gender: 30Gender; Inside Diameter: 1.78mm; Supplier: Future Electronics; Supplier Part Number: 5322706; Manufacturer Part Number: 5011; RoHS: Yes; Category: Connectors; Stock: 212621; Pricing: 1=0,169, 200=0,164, 500=0,159, 1250=0,154, 3000=0,144 (USD); Length: 11.3mm; Lead Free: 5697LeadFree; ComponentLink1URL: https://datasheet.ciiva.com/11744/0900766b8009b7c7-11744935.pdf?src-supplier=Rs; ComponentLink1Description: https://datasheet.ciiva.com/11744/0900766b8009b7c7-11744935.pdf?src-supplier=Rs; ComponentLink2URL: https://datasheet.ciiva.com/1454/1718230-1454834.pdf?src-supplier=Element14; ComponentLink2Description: https://datasheet.ciiva.com/1454/1718230-1454834.pdf?src-supplier=Element14; ComponentLink3URL: https://datasheet.ciiva.com/46412/1703983-46412138.pdf?src-supplier=Element14; ComponentLink3Description: https://datasheet.ciiva.com/46412/1703983-46412138.pdf?src-supplier=Element14; ComponentLink4URL: https://datasheet.ciiva.com/16351/m60-2p60-16351093.pdf?src-supplier=Future+Electronics; ComponentLink4Description: https://datasheet.ciiva.com/16351/m60-2p60-16351093.pdf?src-supplier=Future+Electronics; ComponentLink5URL: https://datasheet.ciiva.com/2917/5011-2917635.pdf?src-supplier=Digikey; ComponentLink5Description: https://datasheet.ciiva.com/2917/5011-2917635.pdf?src-supplier=Digikey
U2 = GUAGE_IC_30TSSOP: Battery Management Controller/Fuel Gauge Li-Ion/Li-Pol/LiFePO4 5.5V 30-Pin TSSOP T/R; Manufacturer: Texas Instruments; Operating Supply Voltage: 2.6V; Fault Protection: Over Current,Over Temperature,Over/Under Voltage; Interface: SMBus; Min Supply Voltage: 2.4V; Nominal Supply Current: 650uA; Supplier: Digikey; Supplier Part Number: 296-44315-1-ND; Manufacturer Part Number: BQ78350DBTR-R1; RoHS: Yes; Category: Battery Management; Stock: 3289; Pricing: 1=6,12, 10=5,5, 25=5,1996, 100=4,5062, 250=4,27512, 500=3,83606, 1000=3,23523 (USD); Mounting Technology: Surface Mount; Case/Package: TFSOP; Pins: 30; Contact Plating: Gold; Min Operating Temperature: -40°C; Max Operating Temperature: 85°C; Output Voltage: 5.5V; Series: -; Packaging: Cut Tape; Max Supply Voltage: 2.6V; Length: 7.8mm; Width: 4.4mm; Height: 1.2mm; Thickness: 1mm; RoHS Compliant: Yes; Lead Free: Lead Free; ComponentLink1URL: http://www.ti.com/lit/pdf/sluubd3?src-supplier=Digikey; ComponentLink1Description: http://www.ti.com/lit/pdf/sluubd3?src-supplier=Digikey; ComponentLink2URL: http://www.ti.com/general/docs/suppproductinfo.tsp?distId=10&amp;gotoUrl=http%3A%2F%2Fwww.ti.com%2Flit%2Fgpn%2Fbq78350-r1&src-supplier=Digikey; ComponentLink2Description: http://www.ti.com/general/docs/suppproductinfo.tsp?distId=10&amp;gotoUrl=http%3A%2F%2Fwww.ti.com%2Flit%2Fgpn%2Fbq78350-r1&src-supplier=Digikey; ComponentLink3URL: http://www.ti.com/lit/gpn/bq78350-r1?src-supplier=Mouser; ComponentLink3Description: http://www.ti.com/lit/gpn/bq78350-r1?src-supplier=Mouser; ComponentLink4URL: http://www.ti.com/general/docs/lit/getliterature.tsp?genericPartNumber=BQ78350-R1&&fileType=pdf&src-supplier=Avnet; ComponentLink4Description: http://www.ti.com/general/docs/lit/getliterature.tsp?genericPartNumber=BQ78350-R1&&fileType=pdf&src-supplier=Avnet